# EAGLE design LT3045_mini_module (EAGLE 7.6.0)
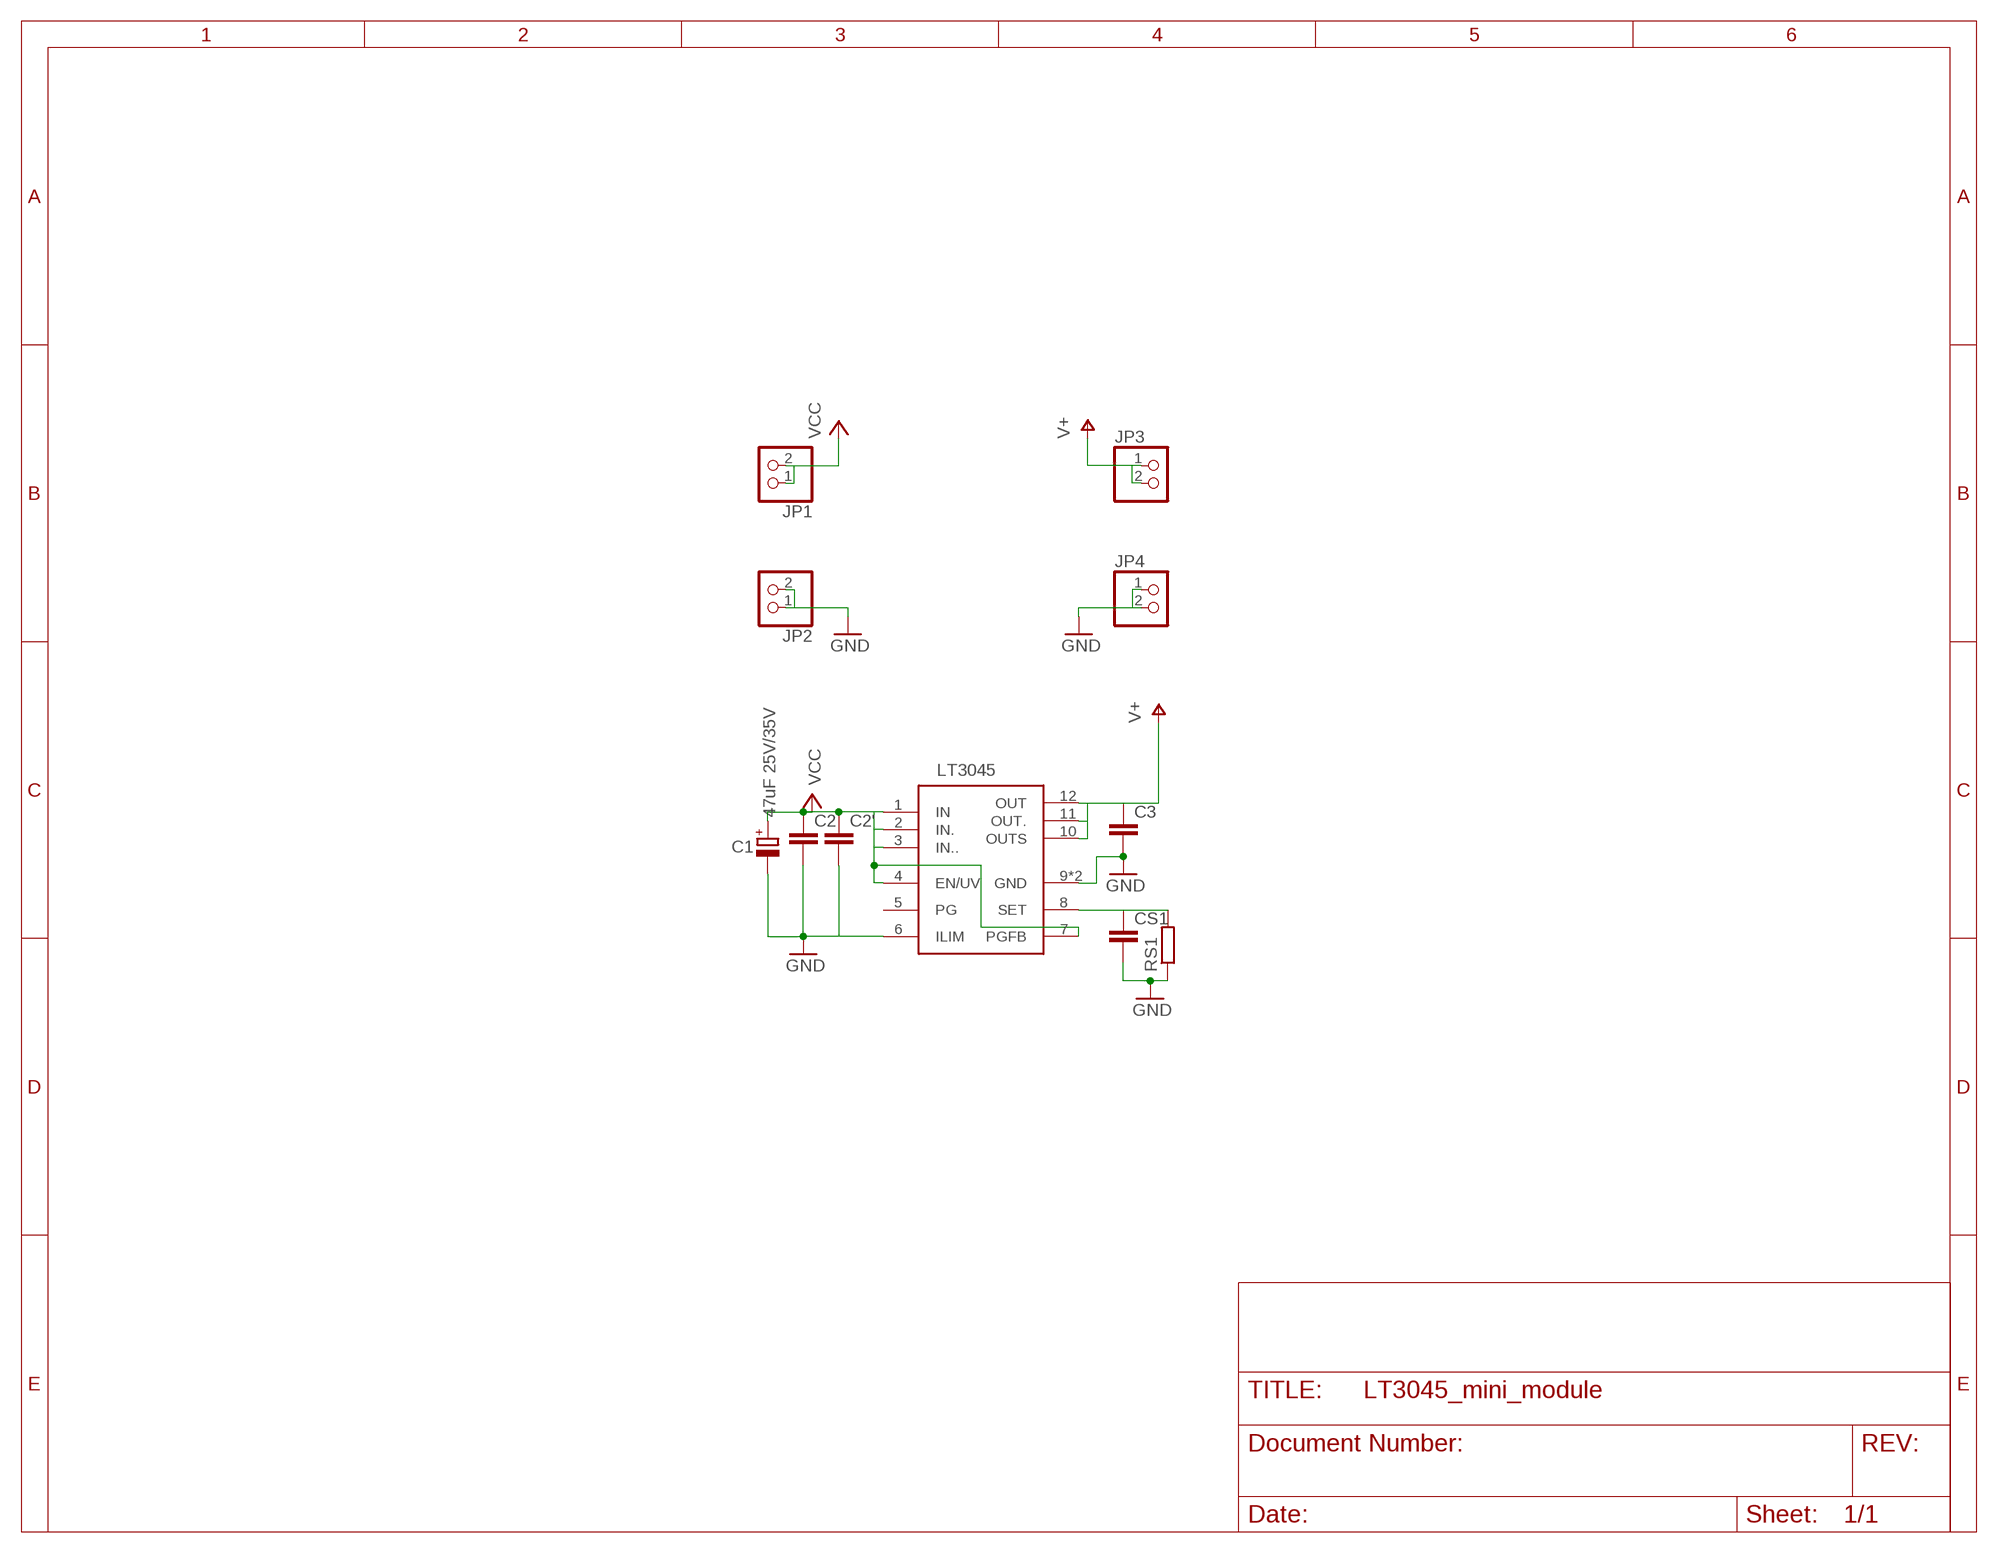
[diagram p0: schematic, sheet 1]

## Parts
C1  47uF 25V/35V  CPOL-EUD/7343-31R  [D/7343-31R]
C2  C-EUC1206  [C1206]
C2'  C-EUC1206  [C1206]
C3  C-EUC1206  [C1206]
CS1  C-EUC1206  [C1206]
JP1  PINHD-1X2  [1X02]
JP2  PINHD-1X2  [1X02]
JP3  PINHD-1X2  [1X02]
JP4  PINHD-1X2  [1X02]
RS1  R-EU_R1206  [R1206]
U1  LT3045  [MSOP12]

## Nets
GND: C1.- C2'.2 C2.2 C3.2 CS1.2 JP2.1 JP2.2 JP4.1 JP4.2 RS1.1 U1.6(ILIM) U1.9(GND) U1.EXP(GND)
SET1: CS1.1 RS1.2 U1.8(SET)
V+: C3.1 JP3.1 JP3.2 U1.10(OUTS) U1.11(OUT.) U1.12(OUT)
VCC: C1.+ C2'.1 C2.1 JP1.1 JP1.2 U1.1(IN) U1.2(IN.) U1.3(IN..) U1.4(EN/UV) U1.7(PGFB)
Unconnected: U1.5(PG)

## Notes on the sheet
- LT3045

## Library data of the parts
C1 = resistor:CPOL-EU: POLARIZED CAPACITOR, European symbol
C2 C2' C3 CS1 = resistor:C-EU: CAPACITOR, European symbol
JP1-JP4 = pinhead:PINHD-1X2: PIN HEADER
RS1 = resistor:R-EU_: RESISTOR, European symbol
U1 = LT3045:LT3045

## Board
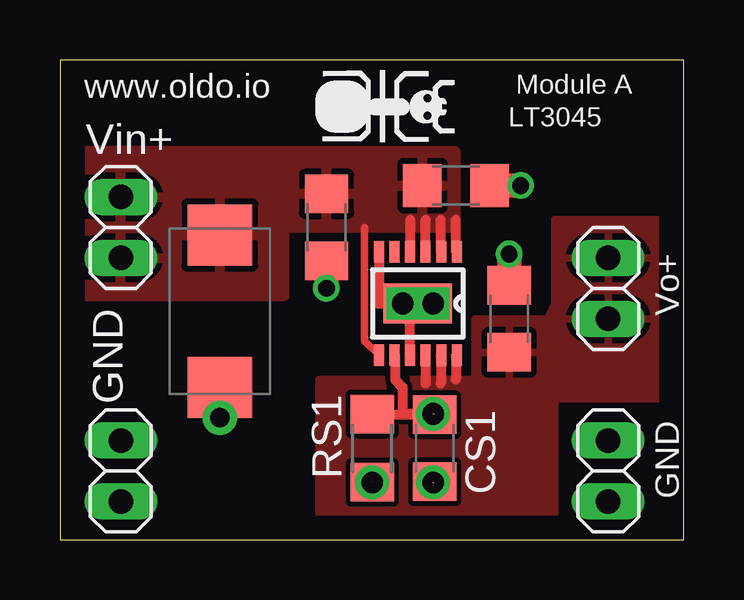
[diagram p1: board, top side]
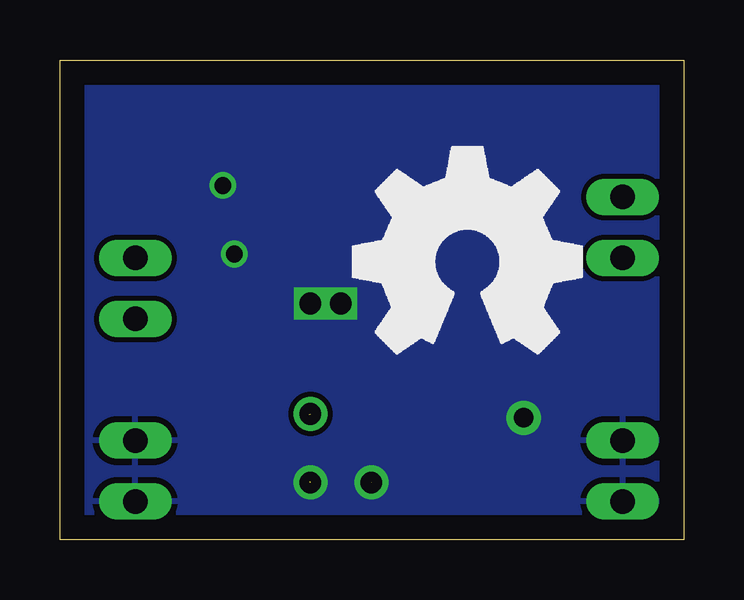
[diagram p2: board, bottom side, seen from below]

Size 26 x 20 mm. Coordinates in mm from the lower left corner, seen from the top.
Outline: 0,0 26,0 26,20 0,20 0,0
Copper layers (1*16): Top 0.035mm / dielectric 1.5mm / Bottom 0.035mm
Design rules "default *": minimum track width 10mil, minimum drill 24mil, track to track 8mil, track to pad 8mil, pad to pad 8mil, via to via 8mil, smd to smd 8mil, copper to edge 40mil, drill to drill 8mil, minimum pad ring 10mil, minimum via ring 8mil, stop-mask expansion 4mil, vias tented up to drill 32mil, thermal gap 10mil

### Footprints (pad centres in the part's own frame; a part is rotated, then mirrored left to right if it is on the bottom)
D/7343-31R = smd 2.55 x 2.7: + 3.175,0; - -3.175,0
C1206 = smd 1.6 x 1.8: 1 -1.4,0; 2 1.4,0
1X02 = drill 1.016 long: 1 -1.27,0; 2 1.27,0
R1206 = smd 1.6 x 1.803: 1 -1.422,0; 2 1.422,0
MSOP12 = smd 0.9 x 0.42: 1 -2.163,1.625; 2 -2.163,0.975; 3 -2.163,0.325; 4 -2.163,-0.325; 5 -2.163,-0.975; 6 -2.163,-1.625; 7 2.15,-1.625; 8 2.15,-0.975; 9 2.15,-0.325; 10 2.15,0.325; 11 2.15,0.975; 12 2.15,1.625 | smd 1.65 x 2.85: EXP 0,0

### Placement (x,y rotation side)
C1  6.67,9.53 90 top
C2  11.11,13.02 270 top
C2'  16.51,14.76 0 top
C3  18.73,9.21 90 top
CS1  15.62,3.81 270 top
JP1  2.54,13.02 90 top
JP2  2.54,2.86 90 top
JP3  22.86,10.48 90 top
JP4  22.86,2.86 90 top
RS1  13.02,3.81 90 top
U1  14.92,9.84 270 top

### Tracks (layer width: path | path; a pad name or v marks a point on that pad's centre or on a via)
GND  (via drill 0.7, 0.8 pad 1.42, 0.9, 0.9 pad 1.42)  (2 unrouted)
  Top 0.305: CS1.2 15.6,2.39
  Top 0.406: U1.6 13.3,9.84 v14.29,9.84 U1.EXP 14.6,9.84 U1.9 | RS1.1 13.04,2.41
  Top 1.016: C1.- v6.67,5.08 | C3.2 v18.73,11.91 | C2.2 v11.11,10.48 | v19.21,14.76 C2'.2
  other vias: 15.56,9.84 15.56,2.38 13.02,2.38
  pour Bottom: 0.95,0.95 25.08,0.95 25.08,19.05 0.95,19.05
SET1  (via drill 0.9 pad 1.42)  (1 unrouted)
  Top 0.305: CS1.1 15.28,5.23
  Top 0.406: U1.8 13.97,7.67 13.97,6.67 14.29,6.35 14.29,5.23 15.28,5.23 | RS1.2 13.04,5.21 CS1.1
  other vias: 15.56,5.24
V+
  Top 0.406: U1.12 16.51,7.66 16.51,6.67 | U1.11 15.88,7.67 15.88,6.51 | U1.10 15.24,6.51
  pour Top: 10.79,6.67 17.3,6.67 17.3,9.21 20.32,9.21 20.64,9.84 20.64,13.34 25.72,13.34 25.72,5.87 20.64,5.87 20.64,0.48 11.11,0.32 10.79,0.64
VCC
  Top 0.305: 13.3,7.62 U1.7 12.7,8.29 12.7,13.02
  Top 0.406: U1.1 16.51,12.04 16.51,13.34 | U1.2 15.88,12.03 15.88,13.34 | U1.3 15.24,12.01 15.24,13.34 | U1.4 14.61,12.01 14.61,13.34
  pour Top: 0.32,16.19 0.32,10.16 9.37,10.16 9.37,13.02 16.51,13.02 16.51,16.19

### Text on the board
tPlace: Module A | www.oldo.io | LT3045 | Vin+ | Vo+ | GND | GND